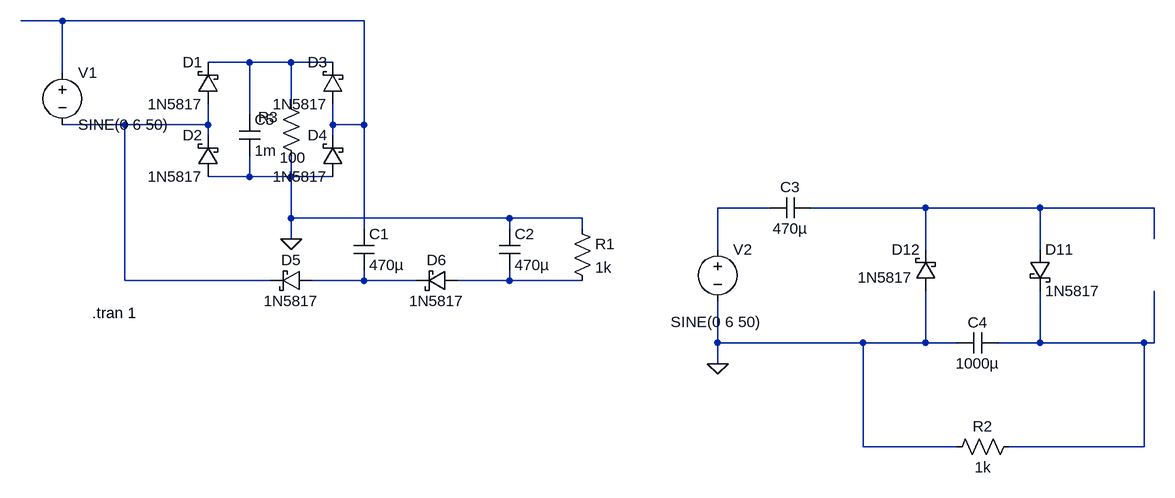
[diagram p0: schematic bridge_neg_supply_dc_bias.asc]
bridge_neg_supply_dc_bias.asc, the LTspice schematic file:
Version 4
SHEET 1 1700 752
WIRE -160 48 -224 48
WIRE 304 48 -160 48
WIRE 128 112 64 112
WIRE 192 112 128 112
WIRE 256 112 192 112
WIRE -160 128 -160 48
WIRE 192 176 192 112
WIRE 128 192 128 112
WIRE -64 208 -160 208
WIRE 64 208 64 176
WIRE 64 208 -64 208
WIRE 256 208 256 176
WIRE 304 208 304 48
WIRE 304 208 256 208
WIRE 64 224 64 208
WIRE 256 224 256 208
WIRE 128 288 128 256
WIRE 128 288 64 288
WIRE 192 288 192 256
WIRE 192 288 128 288
WIRE 256 288 192 288
WIRE 928 336 848 336
WIRE 1168 336 992 336
WIRE 1344 336 1168 336
WIRE 1520 336 1344 336
WIRE 192 352 192 288
WIRE 528 352 192 352
WIRE 640 352 528 352
WIRE 304 368 304 208
WIRE 528 368 528 352
WIRE 640 368 640 352
WIRE 192 384 192 352
WIRE 1520 384 1520 336
WIRE 848 400 848 336
WIRE 1168 400 1168 336
WIRE 1344 400 1344 336
WIRE -64 448 -64 208
WIRE 160 448 -64 448
WIRE 304 448 304 432
WIRE 304 448 224 448
WIRE 384 448 304 448
WIRE 528 448 528 432
WIRE 528 448 448 448
WIRE 640 448 528 448
WIRE 848 544 848 480
WIRE 1072 544 848 544
WIRE 1168 544 1168 464
WIRE 1168 544 1072 544
WIRE 1216 544 1168 544
WIRE 1344 544 1344 464
WIRE 1344 544 1280 544
WIRE 1504 544 1344 544
WIRE 1520 544 1520 464
WIRE 1520 544 1504 544
WIRE 848 576 848 544
WIRE 1072 704 1072 544
WIRE 1216 704 1072 704
WIRE 1504 704 1504 544
WIRE 1504 704 1296 704
FLAG 192 384 0
FLAG 848 576 0
SYMBOL schottky 80 176 R180
WINDOW 0 24 64 Left 2
WINDOW 3 24 0 Left 2
SYMATTR InstName D1
SYMATTR Value 1N5817
SYMATTR Description Diode
SYMATTR Type diode
SYMBOL schottky 80 288 R180
WINDOW 0 24 64 Left 2
WINDOW 3 24 0 Left 2
SYMATTR InstName D2
SYMATTR Value 1N5817
SYMATTR Description Diode
SYMATTR Type diode
SYMBOL schottky 272 176 R180
WINDOW 0 24 64 Left 2
WINDOW 3 24 0 Left 2
SYMATTR InstName D3
SYMATTR Value 1N5817
SYMATTR Description Diode
SYMATTR Type diode
SYMBOL schottky 272 288 R180
WINDOW 0 24 64 Left 2
WINDOW 3 24 0 Left 2
SYMATTR InstName D4
SYMATTR Value 1N5817
SYMATTR Description Diode
SYMATTR Type diode
SYMBOL schottky 224 432 R90
WINDOW 0 0 32 VBottom 2
WINDOW 3 32 32 VTop 2
SYMATTR InstName D5
SYMATTR Value 1N5817
SYMATTR Description Diode
SYMATTR Type diode
SYMBOL schottky 448 432 R90
WINDOW 0 0 32 VBottom 2
WINDOW 3 32 32 VTop 2
SYMATTR InstName D6
SYMATTR Value 1N5817
SYMATTR Description Diode
SYMATTR Type diode
SYMBOL res 624 352 R0
SYMATTR InstName R1
SYMATTR Value 1k
SYMBOL voltage -160 112 R0
WINDOW 123 0 0 Left 0
WINDOW 39 0 0 Left 0
SYMATTR InstName V1
SYMATTR Value SINE(0 6 50)
SYMBOL cap 288 368 R0
SYMATTR InstName C1
SYMATTR Value 470µ
SYMATTR SpiceLine Rser=0.1
SYMBOL cap 512 368 R0
SYMATTR InstName C2
SYMATTR Value 470µ
SYMATTR SpiceLine Rser=0.1
SYMBOL schottky 1328 400 R0
SYMATTR InstName D11
SYMATTR Value 1N5817
SYMATTR Description Diode
SYMATTR Type diode
SYMBOL schottky 1184 464 R180
WINDOW 0 24 64 Left 2
WINDOW 3 36 21 Left 2
SYMATTR InstName D12
SYMATTR Value 1N5817
SYMATTR Description Diode
SYMATTR Type diode
SYMBOL voltage 848 384 R0
WINDOW 3 -72 128 Left 2
WINDOW 123 0 0 Left 0
WINDOW 39 0 0 Left 0
SYMATTR InstName V2
SYMATTR Value SINE(0 6 50)
SYMBOL cap 992 320 R90
WINDOW 0 0 32 VBottom 2
WINDOW 3 32 32 VTop 2
SYMATTR InstName C3
SYMATTR Value 470µ
SYMATTR SpiceLine Rser=0.1
SYMBOL cap 1280 528 R90
WINDOW 0 0 32 VBottom 2
WINDOW 3 32 32 VTop 2
SYMATTR InstName C4
SYMATTR Value 1000µ
SYMATTR SpiceLine Rser=0.1
SYMBOL res 208 272 R180
WINDOW 0 36 76 Left 2
WINDOW 3 -7 13 Left 2
SYMATTR InstName R3
SYMATTR Value 100
SYMBOL res 1312 688 R90
WINDOW 0 0 56 VBottom 2
WINDOW 3 32 56 VTop 2
SYMATTR InstName R2
SYMATTR Value 1k
SYMBOL cap 112 192 R0
SYMATTR InstName C5
SYMATTR Value 1m
TEXT -114 498 Left 2 !.tran 1

The netlist it stands for:
* bridge_neg_supply_dc_bias.asc
D1 N003 N002 1N5817
D2 0 N003 1N5817
D3 N001 N002 1N5817
D4 0 N001 1N5817
D5 N006 N003 1N5817
D6 N007 N006 1N5817
R1 0 N007 1k
V1 N001 N003 SINE(0 6 50)
C1 N001 N006 470µ Rser=0.1
C2 0 N007 470µ Rser=0.1
D11 N005 N008 1N5817
D12 0 N005 1N5817
V2 N004 0 SINE(0 6 50)
C3 N005 N004 470µ Rser=0.1
C4 N008 0 1000µ Rser=0.1
R3 0 N002 100
R2 N008 0 1k
C5 N002 0 1m
.model D D
.lib standard.dio
.tran 1
.backanno
.end